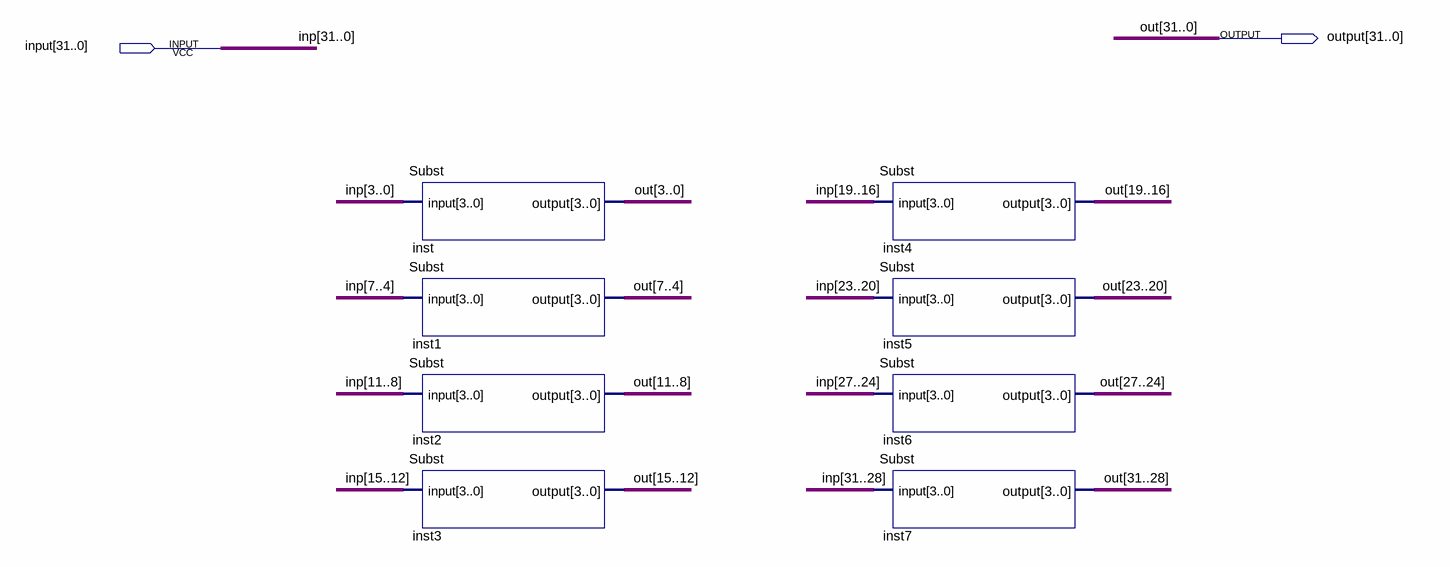
[diagram p0: schematic sheet]
// Quartus schematic Substitute.bdf as structural Verilog: 8 symbols, 2 pins
module Substitute (
  input  [31:0] \input ,
  output [31:0] \output 
);

  Subst inst (.\input (\input [3:0]), .\output (\output [3:0]));
  Subst inst1 (.\input (\input [7:4]), .\output (\output [7:4]));
  Subst inst2 (.\input (\input [11:8]), .\output (\output [11:8]));
  Subst inst3 (.\input (\input [15:12]), .\output (\output [15:12]));
  Subst inst4 (.\input (\input [19:16]), .\output (\output [19:16]));
  Subst inst5 (.\input (\input [23:20]), .\output (\output [23:20]));
  Subst inst6 (.\input (\input [27:24]), .\output (\output [27:24]));
  Subst inst7 (.\input (\input [31:28]), .\output (\output [31:28]));

  // Other names for the same wires on the sheet: inp[31:0] = \input ; out[31:0] = \output 
endmodule
